# Altium schematic sheet Keypadmacro.SchDoc
size 419 x 297 mm
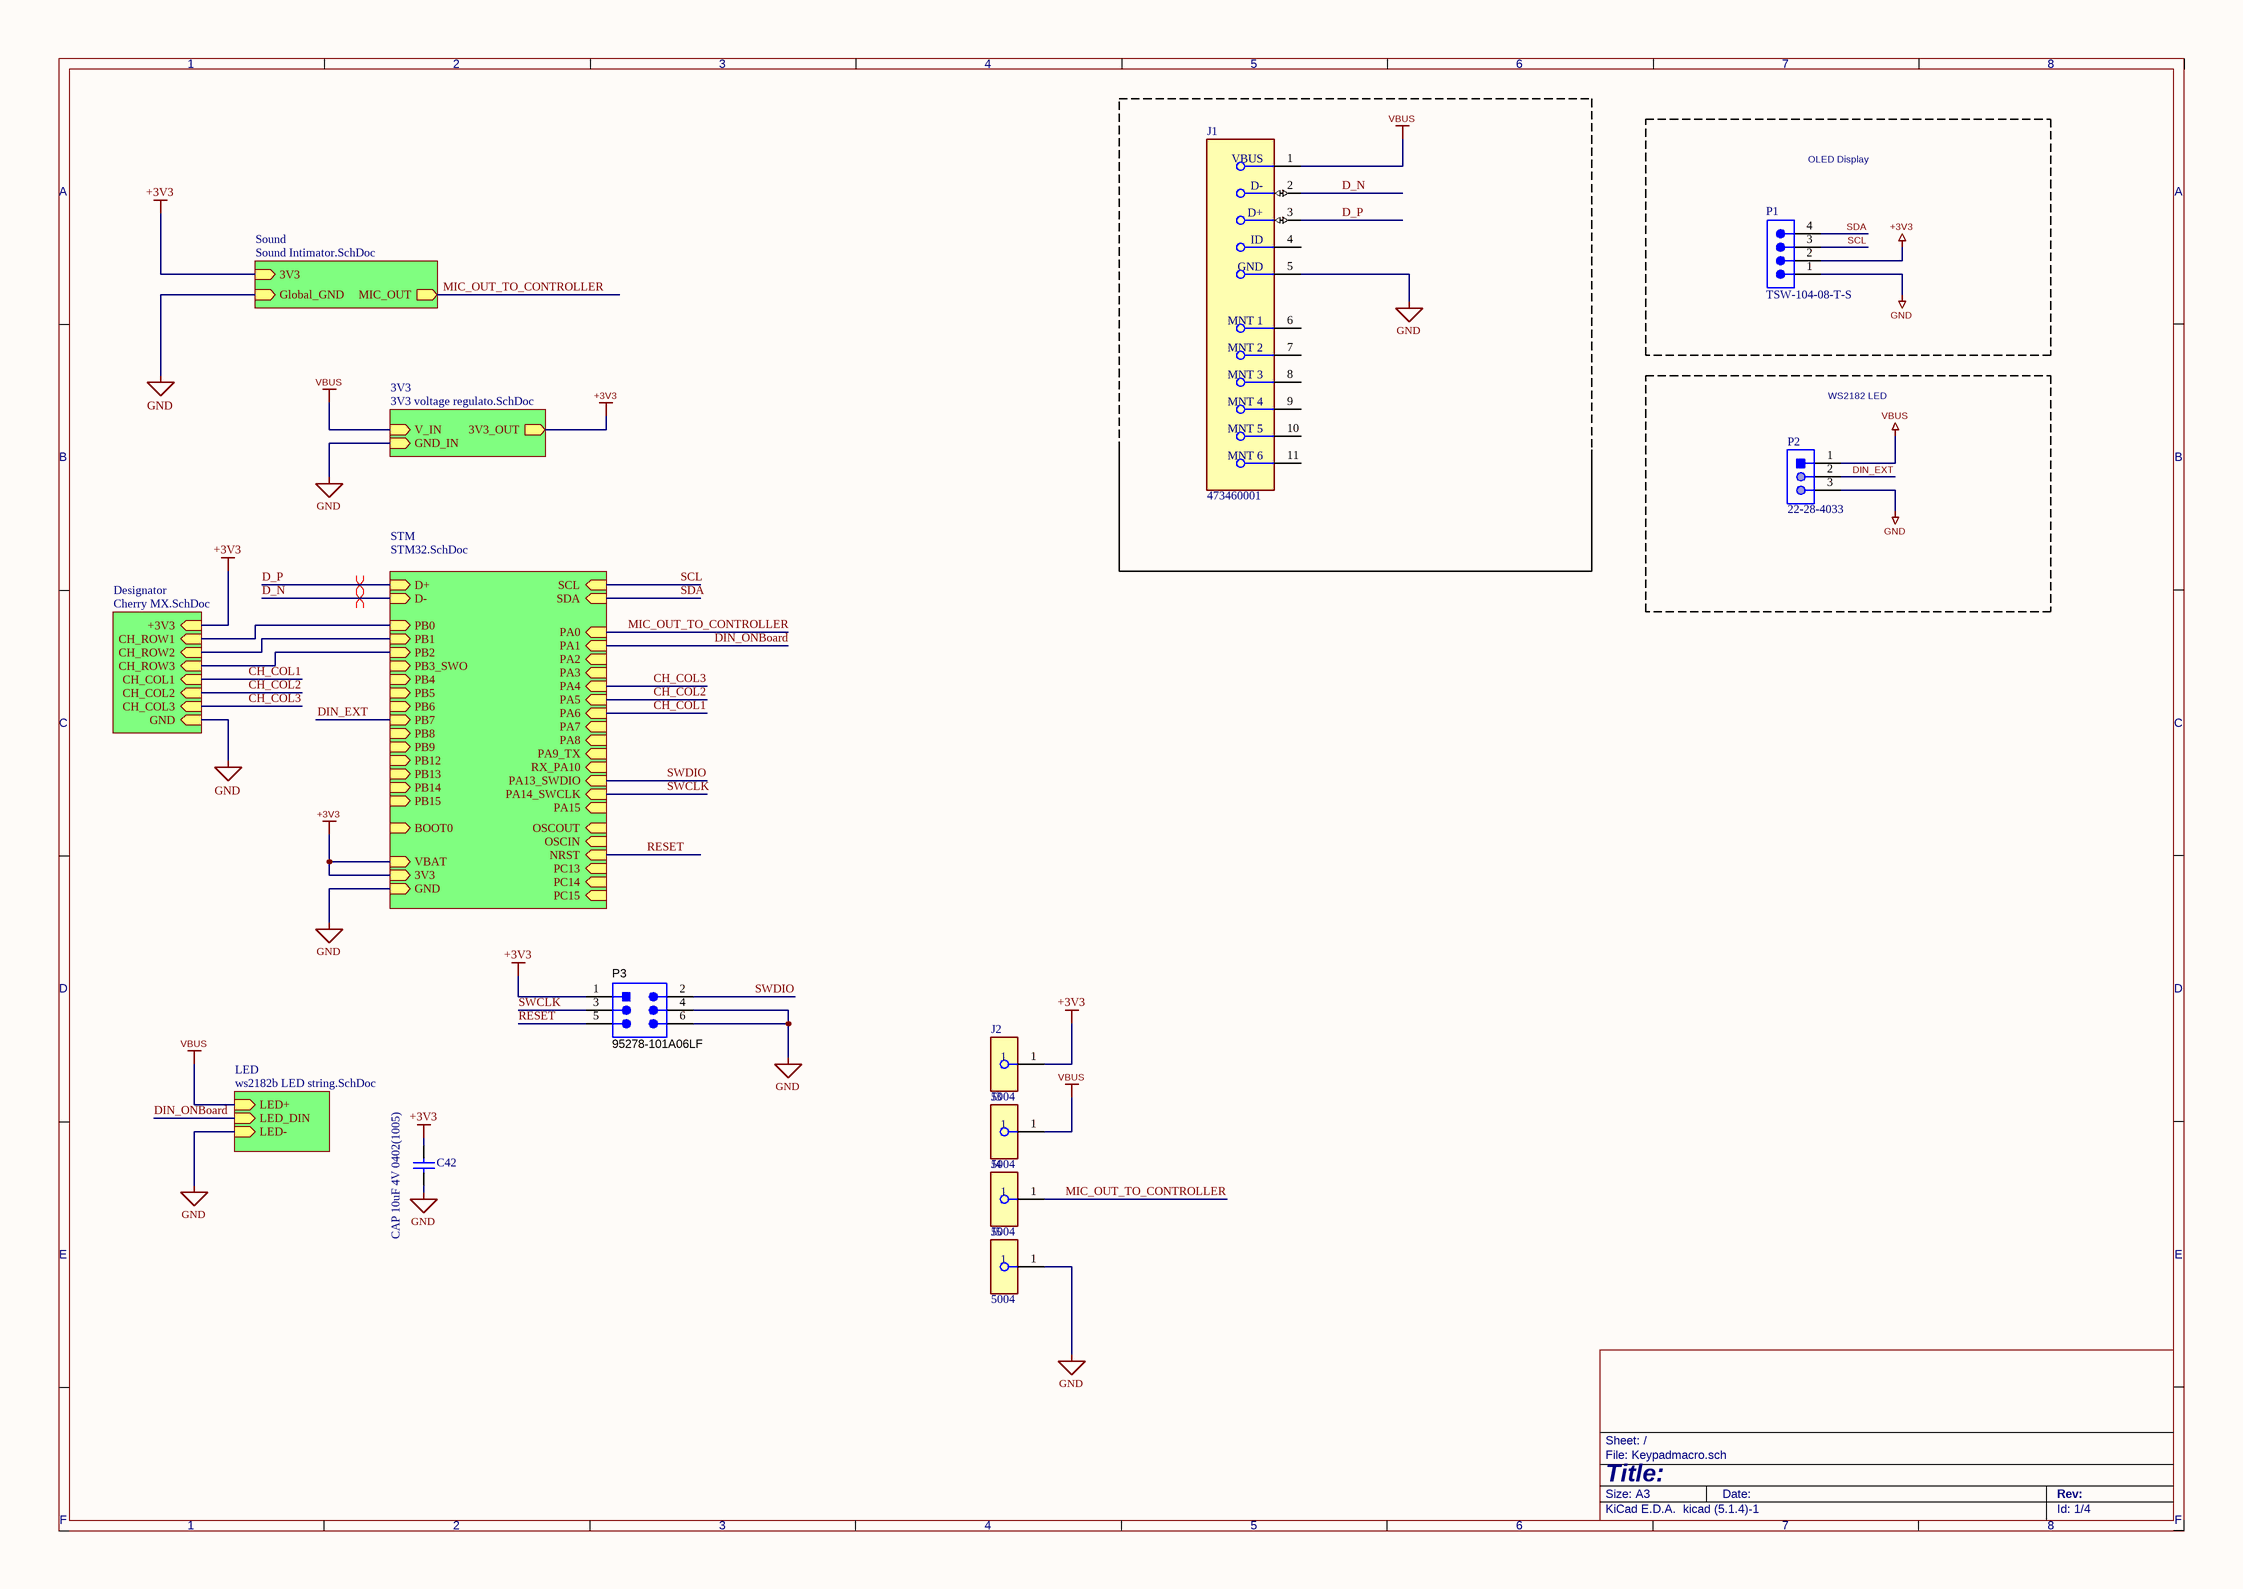
[diagram p0: Keypadmacro.SchDoc]

## Parts
C42  CAP 10uF 4V 0402(1005)  [CAPC0402(1005)60_L]
J1  473460001  [FP-473460001-MFG]
J2  5004  [FP-5004-MFG]
J3  5004  [FP-5004-MFG]
J4  5004  [FP-5004-MFG]
J5  5004  [FP-5004-MFG]
P1  TSW-104-08-T-S  [SMTC-TSW-104-08-X-S]
P2  22-28-4033  [MOLX-22-28-4033_V]
P3  95278-101A06LF  [AMPM-95278-101A06LF_V]

## Blocks framed on the sheet
OLED Display: P1
WS2182 LED: P2

## Sub-sheets
3V3 = 3V3 voltage regulato.SchDoc: 3V3_OUT (out), GND_IN (in), V_IN (in)
Designator = Cherry MX.SchDoc: CH_ROW2 (in), CH_COL3 (in), CH_ROW3 (in), GND (in), +3V3 (in), CH_COL2 (in), CH_ROW1 (in), CH_COL1 (in)
LED = ws2182b LED string.SchDoc: LED+ (in), LED_DIN (in), LED- (in)
Sound = Sound Intimator.SchDoc: 3V3 (in), Global_GND (in), MIC_OUT (out)
STM = STM32.SchDoc: 3V3 (in), VBAT (in), GND (in), D+ (in), D- (in), BOOT0 (in), NRST (in), PA0 (in), PA9_TX (in), PA6 (in), PA7 (in), PA1 (in), PA5 (in), PA3 (in), PA2 (in), PA4 (in), PA8 (in), PB13 (in), PB6 (in), PB9 (in), PB12 (in), PB14 (in), PB0 (in), PB4 (in), PB3_SWO (in), PB1 (in), PB8 (in), PB15 (in), PB5 (in), PB2 (in), PB7 (in), RX_PA10 (in), PC14 (in), PC15 (in), PA15 (in), PC13 (in), SCL (in), OSCIN (in), SDA (in), PA13_SWDIO (in), PA14_SWCLK (in), OSCOUT (in)

## Nets
+3V3: C42.2 J2.1 P1.2 P3.1 ; sheet Sound/3V3, sheet STM/3V3, sheet STM/VBAT, sheet Designator/+3V3, sheet 3V3/3V3_OUT
GND: C42.1 J1.5(GND) J5.1 P1.1 P2.3 P3.4 P3.6 ; sheet Sound/Global_GND, sheet STM/GND, sheet Designator/GND, sheet 3V3/GND_IN, sheet LED/LED-
VBUS: J1.1(VBUS) J3.1 P2.1 ; sheet 3V3/V_IN, sheet LED/LED+
CH_COL1: sheet STM/PA6, sheet Designator/CH_COL1
CH_COL2: sheet STM/PA5, sheet Designator/CH_COL2
CH_COL3: sheet STM/PA4, sheet Designator/CH_COL3
D_N: J1.2(D-) ; sheet STM/D-
D_P: J1.3(D+) ; sheet STM/D+
DIN_EXT: P2.2 ; sheet STM/PB7
DIN_ONBoard: sheet STM/PA1, sheet LED/LED_DIN
MIC_OUT_TO_CONTROLLER: J4.1 ; sheet Sound/MIC_OUT, sheet STM/PA0
RESET: P3.5 ; sheet STM/NRST
SCL: P1.3 ; sheet STM/SCL
SDA: P1.4 ; sheet STM/SDA
SWCLK: P3.3 ; sheet STM/PA14_SWCLK
SWDIO: P3.2 ; sheet STM/PA13_SWDIO
(unnamed): sheet STM/PB0, sheet Designator/CH_ROW1
(unnamed): sheet STM/PB1, sheet Designator/CH_ROW2
(unnamed): sheet STM/PB2, sheet Designator/CH_ROW3

Not connected (* = marked no-connect by the designer): J1 4(ID) 6(MNT_1) 7(MNT_2) 8(MNT_3) 9(MNT_4) 10(MNT_5) 11(MNT_6)

## Layout directives
differential pair; differential pair class STM32_P: D_P
differential pair; differential pair class STM32_N: D_N

## Notes on the sheet
- 1
- 2
- 3
- 4
- 5
- 6
- 7
- 8
- A
- B
- C
- D
- E
- Title:
- File: Keypadmacro.sch
- Sheet: /
- F
- KiCad E.D.A.  kicad (5.1.4)-1
- Size: A3
- Date:
- Rev:
- Id: 1/4

## Library data of the parts
C42 = CMP-1034-02139-1: CAP 10uF 4V ±20% 0402 (1005 Metric) Thickness 0.6mm SMD; Tolerance: Â±20%; Case-EIA: 0402; Case-Metric: 1005; Value: 10uF; Technology: SMT; Max Thickness: 0.6 mm; Rated Voltage: 4 V
J1 = CMP-2000-05246-2: CONN RCPT USB2.0 MICRO B SMD R/A; Manufacturer: Molex; Conn Orientation: Right Angle; Is Female: yes; Shielding: true; Pitch: 0.65mm; Number Of Contacts: 5; Voltage Rating: 30V; Current Rating: 1.8A; Device Class L2: USB Connectors; Digikey Description: CONN RCPT USB2.0 MICRO B SMD R/A; Height: 2.945mm; RoHS: TRUE; ComponentLink2Description: Datasheet; Octopart: https://octopart.com/47346-0001-molex-7164928; Automotive: No; Package: 0; Category: Conn; Device Class L1: Connectors; Usb Standard: USB 2.0; Temperature: -30°C to +85°C; Temperature Range Low: -30°C; Footprint Url: https://www.molex.com/pdm_docs/sd/473460001_sd.pdf; ComponentLink2URL: https://www.molex.com/webdocs/datasheets/pdf/en-us/0473460001_IO_CONNECTORS.pdf; Lead Free: Yes; Manufacturer Part Number: 473460001; Contact Material: Gold,Nickel; Temperature Range High: +85°C; Device Class L3: unset
J2-J5 = CMP-2000-05575-2: PC TEST POINT MINIATURE YELLOW; Manufacturer: Keystone; Number Of Contacts: 1; Is Female: yes; Device Class L1: Connectors; Manufacturer Part Number: 5004; Digikey Description: PC TEST POINT MINIATURE YELLOW; ComponentLink2URL: https://www.keyelco.com/product-pdf.cfm?p=1313; Lead Free: Yes; ComponentLink2Description: Datasheet; Category: Conn; Height: 4.72mm; Octopart: https://octopart.com/5004-keystone-28591; Mouser Description: TEST POINT PC MINI .040"D YELLOW; Device Class L3: unset; Contact Material: Silver; Package: 5004; Automotive: No; Device Class L2: unset; RoHS: TRUE
P1 = CMP-1024-00356-1: 0.025" SQ Post Header, Through-hole, Vertical, -55 to 105 degC, 2.54 mm Pitch, 4-Pin, Male, RoHS; Manufacturer: Samtec; Pitch: 2.54 mm; PackageDescription: .025[0.64] SQ. Post Terminal Strip Assembly; ComponentLink2URL: http://www.samtec.com/documents/webfiles/pdf/TSW_TH.PDF; ComponentLink3URL: http://www.samtec.com/documents/webfiles/cpdf/TSW-XXX-XX-XXX-X-XX-XXX-MKT.pdf; PackageVersion: DM, 8/1988; ComponentLink3Description: Package Specification; DatasheetVersion: F-214; Orientation: Vertical; RoHS: True; Mounting Technology: Through-hole; ComponentLink1URL: http://www.samtec.com; PartNumber: TSW-104-08-T-S; ComponentLink1Description: Manufacturer URL; Temperature Range: -55 to 105 degC; ComponentLink2Description: Datasheet; PackageReference: TSW-104-08-X-S
P2 = CMP-1676-00001-5: Male Header, Pitch 2.54 mm, 1 x 3 Position, Height 8.38 mm, Tail Length 3.18 mm, RoHS, Bulk; Manufacturer: Molex; Rows: 1; Voltage Rating: 250 V; Current Rating: 4 A; Min Operating Temperature: 0 degC; Lead Pitch: 0.1 inch; Packaging: Bulk; Contact Finish: Gold; RoHSCompliant: true; Contact Material: Brass; PackageReference: 22-28-4033; REACH SVHC: Unknown; PackageDescription: Male Header, Pitch 2.54 mm, 1 x 3 Position, Height 8.38 mm, Tail Length 3.18 mm; ComponentLink2URL: http://www.molex.com/pdm_docs/sd/022284033_sd.pdf; Height: 8.38 mm; Mounting Technology: Through Hole; ComponentLink1Description: Manufacturer URL; Length: 7.62 mm; Mount: Through Hole; DatasheetVersion: Rev. G, 01/2012; Max Operating Temperature: 75 degC; ComponentLink2Description: Datasheet; Colour: Black; Pins: 3; Contact Plating: Gold; Package Quantity: 1; ComponentLink1URL: http://www.molex.com/
P3 = CMP-1743-00002-1: Male Header, Pitch 2.54 mm, 2 x 3 Position, Height 14.4 mm, RoHS, Tape and Reel; Power Rating: 100 mW; Tolerance: 1%; Resistance: 49.9 Ohm; Case\Package: 0603; Voltage Rating: 50 V; DatasheetVersion: Rev. AC, 03/2016; PackageDescription: Male Header, Pitch 2.54 mm, 2 x 3 Position, Height 14.4 mm; REACH SVHC: No SVHC; Height: 0.45 mm; Mount: Surface Mount; Case Code (Imperial): 0603; Max Operating Temperature: 155 degC; Case Code (Metric): 1608; Packaging: Tape and Reel; RoHSCompliant: true; ComponentLink1Description: Datasheet; Min Operating Temperature: -55 degC; Length: 1.6 mm; Width: 0.8 mm; ComponentLink1URL: http://portal.fciconnect.com/Comergent//fci/drawing/95278.pdf; PackageReference: 95278-101A06LF